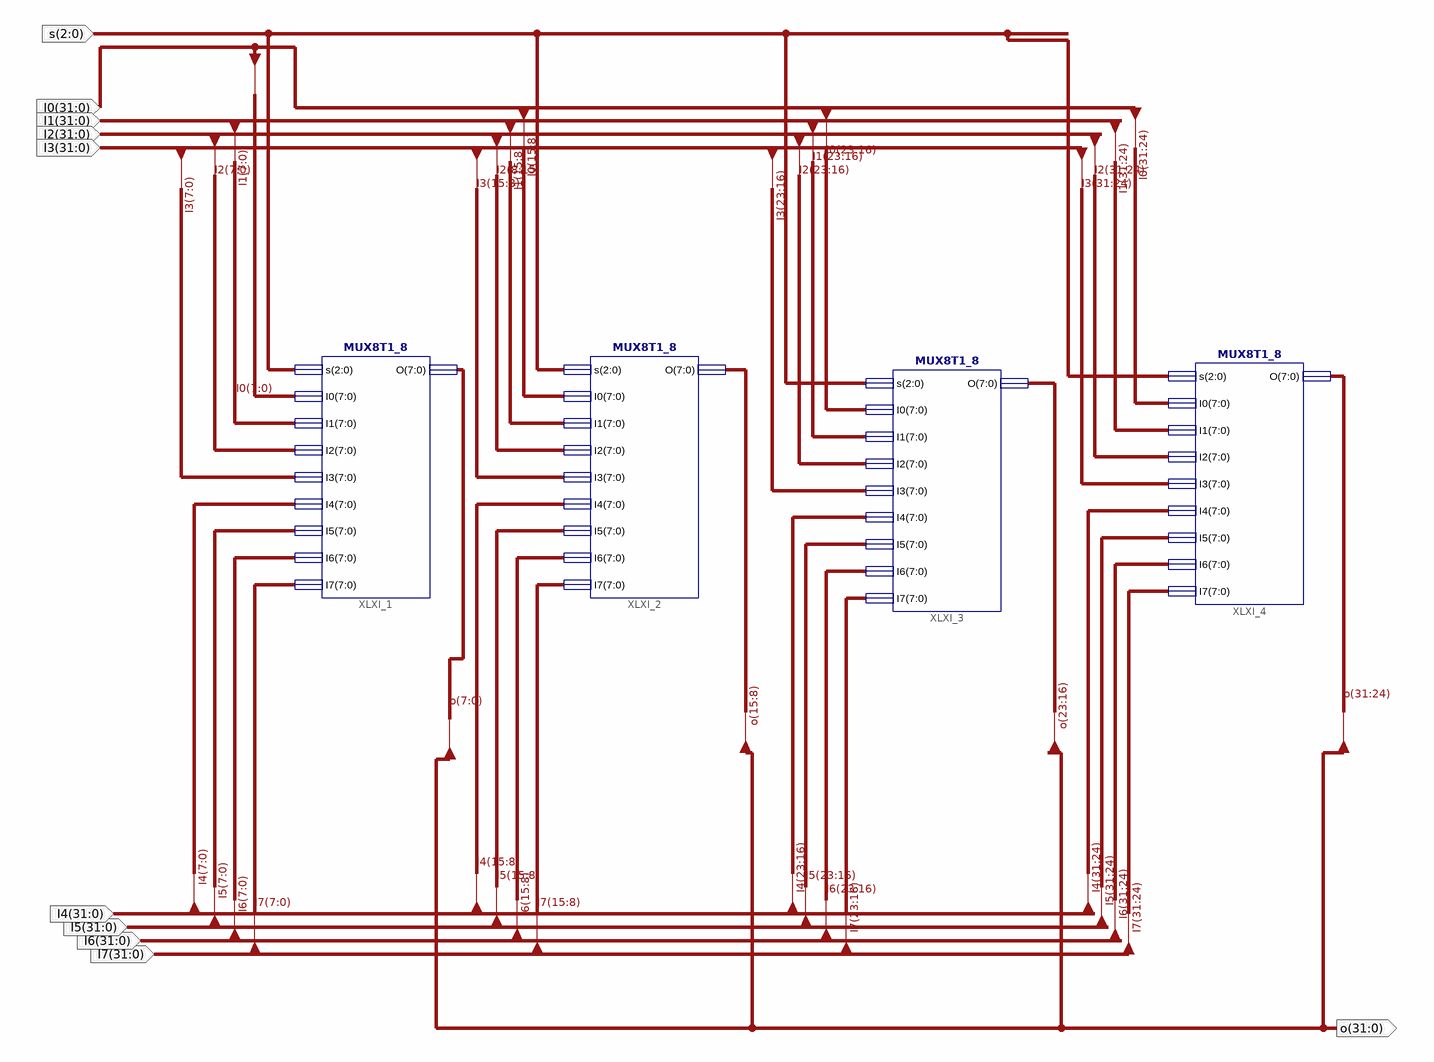
[diagram p0: schematic sheet 1]
// Xilinx ISE schematic MUX8T1_32.sch (kintex7) as structural Verilog: 4 symbols, 10 ports
module MUX8T1_32 (
  input  [31:0] I7,
  input  [31:0] I1,
  input  [31:0] I2,
  input  [31:0] I3,
  input  [31:0] I6,
  input  [31:0] I5,
  input  [31:0] I4,
  input  [2:0] s,
  input  [31:0] I0,
  output [31:0] o
);

  MUX8T1_8 XLXI_1 (
    .I0(I0[7:0]), .I1(I1[7:0]), .I2(I2[7:0]), .I3(I3[7:0]), .I4(I4[7:0]), .I5(I5[7:0]), .I6(I6[7:0]),
    .I7(I7[7:0]), .O(o[7:0]), .s(s));
  MUX8T1_8 XLXI_2 (
    .I0(I0[15:8]), .I1(I1[15:8]), .I2({I2[8], I2[9], I2[10], I2[11], I2[12], I2[13], I2[14], I2[15]}),
    .I3(I3[15:8]), .I4(I4[15:8]), .I5(I5[15:8]), .I6(I6[15:8]), .I7(I7[15:8]), .O(o[15:8]), .s(s));
  MUX8T1_8 XLXI_3 (
    .I0(I0[23:16]), .I1(I1[23:16]), .I2(I2[23:16]), .I3(I3[23:16]), .I4(I4[23:16]), .I5(I5[23:16]),
    .I6(I6[23:16]), .I7(I7[23:16]), .O(o[23:16]), .s(s));
  MUX8T1_8 XLXI_4 (
    .I0(I0[31:24]), .I1(I1[31:24]), .I2(I2[31:24]), .I3(I3[31:24]), .I4(I4[31:24]), .I5(I5[31:24]),
    .I6(I6[31:24]), .I7(I7[31:24]), .O(o[31:24]), .s(s));
endmodule
